# Altium schematic sheet Thermocouple.SchDoc
size A
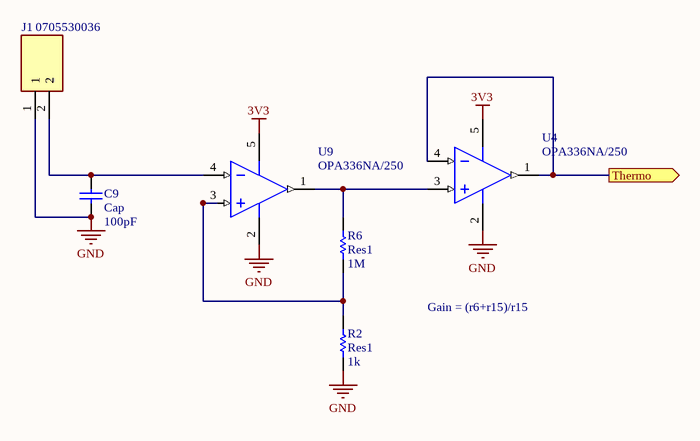
[diagram p0: Thermocouple.SchDoc]

## Parts
C9  Cap  value 100pF  [0402-A]
J1  0705530036  [SHDRRA2W64P0X254_1X2_737X1359X699P]
R2  Res1  value 1k  [0402-A]
R6  Res1  value 1M  [0402-A]
U4  OPA336NA/250  [DBV0005A_M]
U9  OPA336NA/250  [DBV0005A_M]

## Ports
Thermo (out)

## Nets
3V3: U4.5(V+) U9.5(V+)
GND: C9.1 J1.1 R2.2 U4.2(V-) U9.2(V-)
Thermo: U4.1(OUT) U4.4(IN-) ; port Thermo
NetC9_2: C9.2 J1.2 U9.4(IN-)
NetR2_1: R2.1 R6.2 U9.3(IN+)
NetR6_1: R6.1 U4.3(IN+) U9.1(OUT)

## Notes on the sheet
- Gain = (r6+r15)/r15

## Library data of the parts
C9 = Cap: Capacitor; Published: 8-Jun-2000; LatestRevisionDate: 17-Jul-2002; LatestRevisionNote: Re-released for DXP Platform.; PackageReference: RAD-0.3; Publisher: Altium Limited; PackageDescription: Radial Cap, Thru-Hole; 2 Leads; 0.3 in Pin Spacing
J1 = 0705530036: Connector; Manufacturer_Name: Molex; Datasheet Link: https://www.molex.com/pdm_docs/sd/705530036_sd.pdf; Height: 6.99mm; Manufacturer_Part_Number: 0705530036; Mouser Part Number: N/A; Mouser Price/Stock: https://www.mouser.com/Search/Refine.aspx?Keyword=N%2FA; Arrow Part Number: 0705530036; Arrow Price/Stock: https://www.arrow.com/en/products/0705530036/molex
R2 R6 = Res1: Resistor; Published: 8-Jun-2000; LatestRevisionDate: 17-Jul-2002; LatestRevisionNote: Re-released for DXP Platform.; PackageReference: AXIAL-0.3; Publisher: Altium Limited; PackageDescription: Axial Device, Thru-Hole; 2 Leads; 0.3 in Pin Spacing
U4 U9 = CMP-0272-00910-3: Single-Supply, MicroPower CMOS Operational Amplifier MicroAmplifier(TM) Series, 2.3 to 5.5 V, -55 to 125 degC, 5-pin SOT23 (DBV5), Green (RoHS & no Sb/Br); Manufacturer: Texas Instruments; Slew Rate(Typ)(V/us): 0.03; Iq per channel(Max)(mA): 0.032; Number of Channels: 1; Offset Drift(Typ)(uV/C): 1.5; IIB(Max)(pA): 10; Total Supply Voltage(Max)(+5V is 5, +/-5V is 10): 5.5; Vio (25C)(Max)(mV): 0.5; CMRR(Min)(dB): 76; Total Supply Voltage(Min)(+5V is 5, +/-5V is 10): 2.3; Sub Family: Low Input Bias Current Amp (<=10pA), Low Offset Voltage Amplifier (<=500uV), Low Power Amp (<=500uA), Low Supply Voltage Amplifier (<=2.7V), Precision Amplifier; Vn at 1kHz(Typ)(nV/rtHz): 40; DatasheetVersion: SBOS068C; ComponentLink1URL: http://www.ti.com/; ComponentLink2Description: Datasheet; PackageReference: DBV0005A; ComponentLink3Description: Package Specification; ComponentLink2URL: http://www.ti.com/general/docs/lit/getliterature.tsp?genericPartNumber=OPA336&fileType=pdf; Mounting Technology: Surface Mount; Eco-Plan: Green (RoHS & no Sb/Br); Code_JEDEC: MO-178; ComponentLink3URL: http://www.ti.com/litv/pdf/mpds018i; PackageDescription: 5-Pin Plastic Small Outline, Body 1.6 x 2.9 mm, Pitch 0.95 mm; PartNumber: OPA336NA/250; PackageVersion: 4073253-4/K, 03/2006; ComponentLink1Description: Manufacturer URL